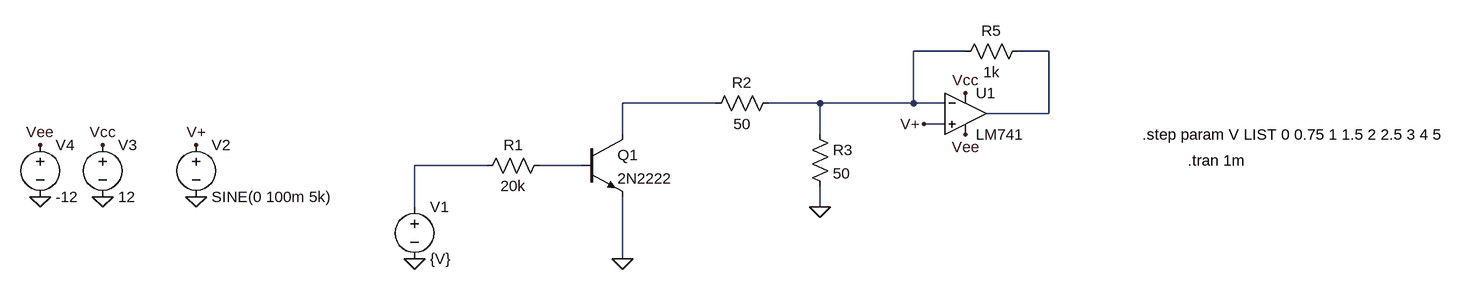
[diagram p0: schematic Voltage Controlled Amplifier.asc]
Voltage Controlled Amplifier.asc, the LTspice schematic file:
Version 4
SHEET 1 1656 680
WIRE 704 -80 624 -80
WIRE 832 -80 784 -80
WIRE 320 0 176 0
WIRE 480 0 400 0
WIRE 624 0 624 -80
WIRE 624 0 480 0
WIRE 672 0 624 0
WIRE 832 16 832 -80
WIRE 832 16 736 16
WIRE 672 32 640 32
WIRE 176 48 176 0
WIRE 480 48 480 0
WIRE -32 96 -144 96
WIRE 112 96 48 96
WIRE -144 160 -144 96
WIRE 480 160 480 128
WIRE 176 240 176 144
FLAG -144 240 0
FLAG 176 240 0
FLAG 480 160 0
FLAG -480 144 0
FLAG -480 64 V+
FLAG 640 32 V+
FLAG -720 144 0
FLAG -624 144 0
FLAG -624 64 Vcc
FLAG -720 64 Vee
FLAG 704 -16 Vcc
FLAG 704 48 Vee
SYMBOL voltage -144 144 R0
WINDOW 123 0 0 Left 0
WINDOW 39 0 0 Left 0
SYMATTR InstName V1
SYMATTR Value {V}
SYMBOL res 64 80 R90
WINDOW 0 0 56 VBottom 2
WINDOW 3 32 56 VTop 2
SYMATTR InstName R1
SYMATTR Value 20k
SYMBOL npn 112 48 R0
SYMATTR InstName Q1
SYMATTR Value 2N2222
SYMBOL res 416 -16 R90
WINDOW 0 0 56 VBottom 2
WINDOW 3 32 56 VTop 2
SYMATTR InstName R2
SYMATTR Value 50
SYMBOL res 464 32 R0
SYMATTR InstName R3
SYMATTR Value 50
SYMBOL voltage -480 48 R0
WINDOW 123 0 0 Left 0
WINDOW 39 0 0 Left 0
SYMATTR InstName V2
SYMATTR Value SINE(0 100m 5k)
SYMBOL res 800 -96 R90
WINDOW 0 0 56 VBottom 2
WINDOW 3 32 56 VTop 2
SYMATTR InstName R5
SYMATTR Value 1k
SYMBOL voltage -624 48 R0
WINDOW 123 0 0 Left 0
WINDOW 39 0 0 Left 0
SYMATTR InstName V3
SYMATTR Value 12
SYMBOL voltage -720 48 R0
WINDOW 123 0 0 Left 0
WINDOW 39 0 0 Left 0
SYMATTR InstName V4
SYMATTR Value -12
SYMBOL LM741 704 -48 R0
SYMATTR InstName U1
TEXT 1046 88 Left 2 !.tran 1m
TEXT 976 48 Left 2 !.step param V LIST 0 0.75 1 1.5 2 2.5 3 4 5

The netlist it stands for:
* Voltage Controlled Amplifier.asc
V1 N004 0 {V}
R1 N005 N004 20k
Q1 N003 N005 0 0 2N2222
R2 N001 N003 50
R3 N001 0 50
V2 V+ 0 SINE(0 100m 5k)
R5 N002 N001 1k
V3 Vcc 0 12
V4 Vee 0 -12
XU1 V+ N001 Vcc Vee N002 LM741  ; pins In+ In- V+ V- OUT
.model NPN NPN
.model PNP PNP
.lib standard.bjt
.tran 1m
.step param V LIST 0 0.75 1 1.5 2 2.5 3 4 5
.lib LM741.lib
.backanno
.end